# Altium schematic sheet MicroMultimeter_MCU_Sch.SchDoc: MicroMultimeter - MCU
size 203 x 203 mm; Author: Hom; CompanyName: KitSprout; DrawnBy: Hom; Engineer: Hom; Organization: KitSprout; Revision: A; SheetNumber: 1; SheetTotal: 1; License: CC BY-SA 4.0; Version: 1.0; LibVersion: 1.4; PageSetup: Record=PageOptions|CenterHorizontal=True|CenterVertical=True|PrintScale=1.00|XCorrection=1.00|YCorrection=1.00|PrintKind=0|BorderSize=5000000|LeftOffset=0|BottomOffset=0|Orientation=2|PaperLength=1000|PaperWidth=1000|Scale=100|PaperSource=7|PrintQuality=-3|MediaType=1|DitherType=10|PrintScaleMode=0|PaperKind=A4|PaperIndex=9
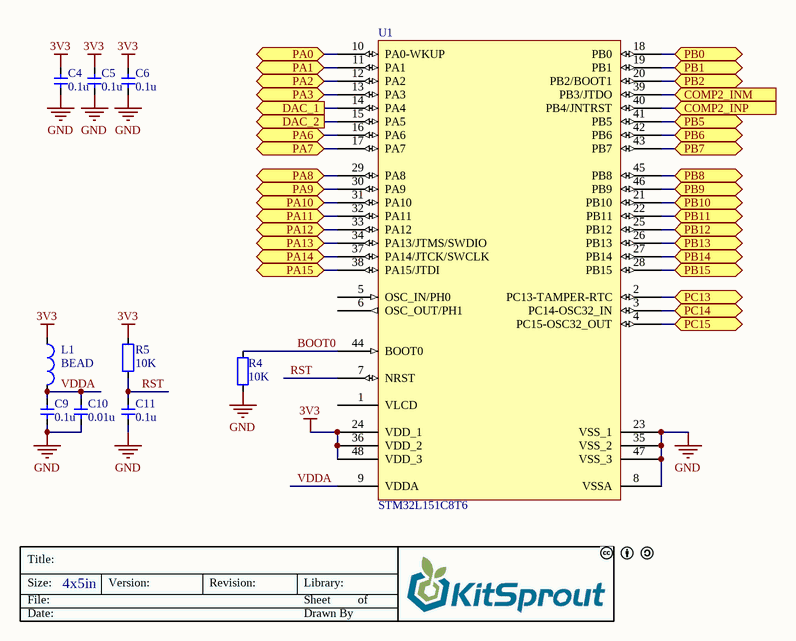
[diagram p0: MicroMultimeter_MCU_Sch.SchDoc]

## Parts
C4  value 0.1u  [CAP_0603]  (hidden comment: Cap_0603)
C5  value 0.1u  [CAP_0603]  (hidden comment: Cap_0603)
C6  value 0.1u  [CAP_0603]  (hidden comment: Cap_0603)
C9  value 0.1u  [CAP_0603]  (hidden comment: Cap_0603)
C10  value 0.01u  [CAP_0603]  (hidden comment: Cap_0603)
C11  value 0.1u  [CAP_0603]  (hidden comment: Cap_0603)
L1  value BEAD  [IND_0603]  (hidden comment: Ind_0603)
R4  value 10K  [RES_0603]  (hidden comment: Res_0603)
R5  value 10K  [RES_0603]  (hidden comment: Res_0603)
U1  STM32L151C8T6  [LQFP48_N]

## Ports
COMP2_INM (in), COMP2_INP (in), DAC_1 (out), DAC_2 (out), PA0, PA1, PA2, PA3, PA6, PA7, PA8, PA9, PA10, PA11, PA12, PA13, PA14, PA15, PB0, PB1, PB2, PB5, PB6, PB7, PB8, PB9, PB10, PB11, PB12, PB13, PB14, PB15, PC13, PC14, PC15

## Nets
3V3: C4.2 C5.2 C6.2 L1.1 R5.2 U1.24(VDD_1) U1.36(VDD_2) U1.48(VDD_3)
GND: C4.1 C5.1 C6.1 C9.1 C10.1 C11.1 R4.1 U1.8(VSSA) U1.23(VSS_1) U1.35(VSS_2) U1.47(VSS_3)
BOOT0: R4.2 U1.44(BOOT0)
COMP2_INM: U1.39(PB3/JTDO) ; port COMP2_INM
COMP2_INP: U1.40(PB4/JNTRST) ; port COMP2_INP
DAC_1: U1.14(PA4) ; port DAC_1
DAC_2: U1.15(PA5) ; port DAC_2
PA0: U1.10(PA0-WKUP) ; port PA0
PA1: U1.11(PA1) ; port PA1
PA2: U1.12(PA2) ; port PA2
PA3: U1.13(PA3) ; port PA3
PA6: U1.16(PA6) ; port PA6
PA7: U1.17(PA7) ; port PA7
PA8: U1.29(PA8) ; port PA8
PA9: U1.30(PA9) ; port PA9
PA10: U1.31(PA10) ; port PA10
PA11: U1.32(PA11) ; port PA11
PA12: U1.33(PA12) ; port PA12
PA13: U1.34(PA13/JTMS/SWDIO) ; port PA13
PA14: U1.37(PA14/JTCK/SWCLK) ; port PA14
PA15: U1.38(PA15/JTDI) ; port PA15
PB0: U1.18(PB0) ; port PB0
PB1: U1.19(PB1) ; port PB1
PB2: U1.20(PB2/BOOT1) ; port PB2
PB5: U1.41(PB5) ; port PB5
PB6: U1.42(PB6) ; port PB6
PB7: U1.43(PB7) ; port PB7
PB8: U1.45(PB8) ; port PB8
PB9: U1.46(PB9) ; port PB9
PB10: U1.21(PB10) ; port PB10
PB11: U1.22(PB11) ; port PB11
PB12: U1.25(PB12) ; port PB12
PB13: U1.26(PB13) ; port PB13
PB14: U1.27(PB14) ; port PB14
PB15: U1.28(PB15) ; port PB15
PC13: U1.2(PC13-TAMPER-RTC) ; port PC13
PC14: U1.3(PC14-OSC32_IN) ; port PC14
PC15: U1.4(PC15-OSC32_OUT) ; port PC15
RST: C11.2 R5.1 U1.7(NRST)
VDDA: C9.2 C10.2 L1.2 U1.9(VDDA)

Not connected (* = marked no-connect by the designer): U1 1(VLCD) 5(OSC_IN/PH0) 6(OSC_OUT/PH1)

## Notes on the sheet
- Title:
- Size:
- Date:
- File:
- 4x5in
- Version:
- Revision:
- Sheet
- Drawn By
- Library:
- of

## Library data of the parts
C4-C6 C9-C11 = Cap_0603: Capacitor
L1 = Ind_0603: Inductor
R4 R5 = Res_0603: Resistor
U1 = STM32L151C8T6: STM32 ARM-based 32-bit MCU with 64 Kbytes Flash, 48-pin LQFP, Industrial Temperature; Published: 30-May-2008; DatasheetVersion: rev6, Mar-2008; PackageVersion: Mar-2008; PackageReference: LQFP48; Publisher: Altium Limited; PackageDescription: 48-Pin Low-Profile Quad Flat Pack, 7 x 7 mm Body, 0.5 mm Pitch (LQFP48); ComponentLink1Description: Manufacturer Link; ComponentLink1URL: www.st.com/stm32; ComponentLink2Description: Datasheet; ComponentLink2URL: http://www.st.com/stonline/products/literature/ds/13586.pdf